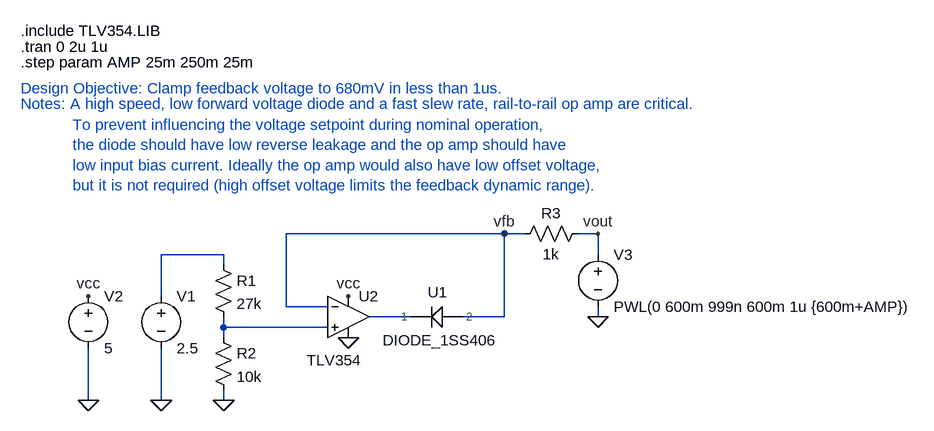
[diagram p0: schematic feedback_clamp.asc]
feedback_clamp.asc, the LTspice schematic file:
Version 4
SHEET 1 1108 680
WIRE 432 192 96 192
WIRE 464 192 432 192
WIRE 576 192 544 192
WIRE 0 224 -96 224
WIRE 576 224 576 192
WIRE 0 240 0 224
WIRE -96 288 -96 224
WIRE 96 304 96 192
WIRE 160 304 96 304
WIRE 288 320 224 320
WIRE 432 320 432 192
WIRE 432 320 368 320
WIRE 576 320 576 304
WIRE 0 336 0 320
WIRE 160 336 0 336
WIRE 0 352 0 336
WIRE -208 448 -208 368
WIRE -96 448 -96 368
WIRE 0 448 0 432
FLAG -96 448 0
FLAG 0 448 0
FLAG -208 448 0
FLAG 576 320 0
FLAG -208 288 vcc
FLAG 192 288 vcc
FLAG 192 352 0
FLAG 432 192 vfb
FLAG 576 192 vout
SYMBOL voltage -96 272 R0
SYMATTR InstName V1
SYMATTR Value 2.5
SYMBOL res -16 224 R0
SYMATTR InstName R1
SYMATTR Value 27k
SYMBOL res -16 336 R0
SYMATTR InstName R2
SYMATTR Value 10k
SYMBOL voltage -208 272 R0
SYMATTR InstName V2
SYMATTR Value 5
SYMBOL res 560 176 R90
WINDOW 0 0 56 VBottom 2
WINDOW 3 32 56 VTop 2
SYMATTR InstName R3
SYMATTR Value 1k
SYMBOL voltage 576 208 R0
WINDOW 123 0 0 Left 0
WINDOW 39 0 0 Left 0
SYMATTR InstName V3
SYMATTR Value PWL(0 600m 999n 600m 1u {600m+AMP})
SYMBOL Opamps\\opamp2 192 256 R0
WINDOW 3 -64 131 Left 2
SYMATTR InstName U2
SYMATTR Value TLV354
SYMBOL 1SS406 304 304 R0
WINDOW 0 10 -22 Left 2
WINDOW 3 -59 52 Left 2
SYMATTR InstName U1
TEXT -312 -96 Left 2 !.tran 0 2u 1u
TEXT -312 -120 Left 2 !.include TLV354.LIB
TEXT -312 -72 Left 2 !.step param AMP 25m 250m 25m
TEXT -312 -32 Left 2 ;Design Objective: Clamp feedback voltage to 680mV in less than 1us.
TEXT -312 -8 Left 2 ;Notes: A high speed, low forward voltage diode and a fast slew rate, rail-to-rail op amp are critical.
TEXT -232 24 Left 2 ;To prevent influencing the voltage setpoint during nominal operation,\nthe diode should have low reverse leakage and the op amp should have\nlow input bias current. Ideally the op amp would also have low offset voltage,\nbut it is not required (high offset voltage limits the feedback dynamic range).

The netlist it stands for:
* feedback_clamp.asc
V1 N001 0 2.5
R1 N001 N003 27k
R2 N003 0 10k
V2 vcc 0 5
R3 vout vfb 1k
V3 vout 0 PWL(0 600m 999n 600m 1u {600m+AMP})
XU2 N003 vfb vcc 0 N002 TLV354  ; pins In+ In- V+ V- OUT
XU1 vfb N002 DIODE_1SS406  ; pins 2 1
.tran 0 2u 1u
.include TLV354.LIB
.step param AMP 25m 250m 25m
* Design Objective: Clamp feedback voltage to 680mV in less than 1us.
* Notes: A high speed, low forward voltage diode and a fast slew rate, rail-to-rail op amp are critical.
* To prevent influencing the voltage setpoint during nominal operation,
* the diode should have low reverse leakage and the op amp should have
* low input bias current. Ideally the op amp would also have low offset voltage,
* but it is not required (high offset voltage limits the feedback dynamic range).
.lib 1SS406.mod
.backanno
.end